# Altium schematic sheet chickenFlap.SchDoc
size A4; SheetNumber: 1; SheetTotal: 3
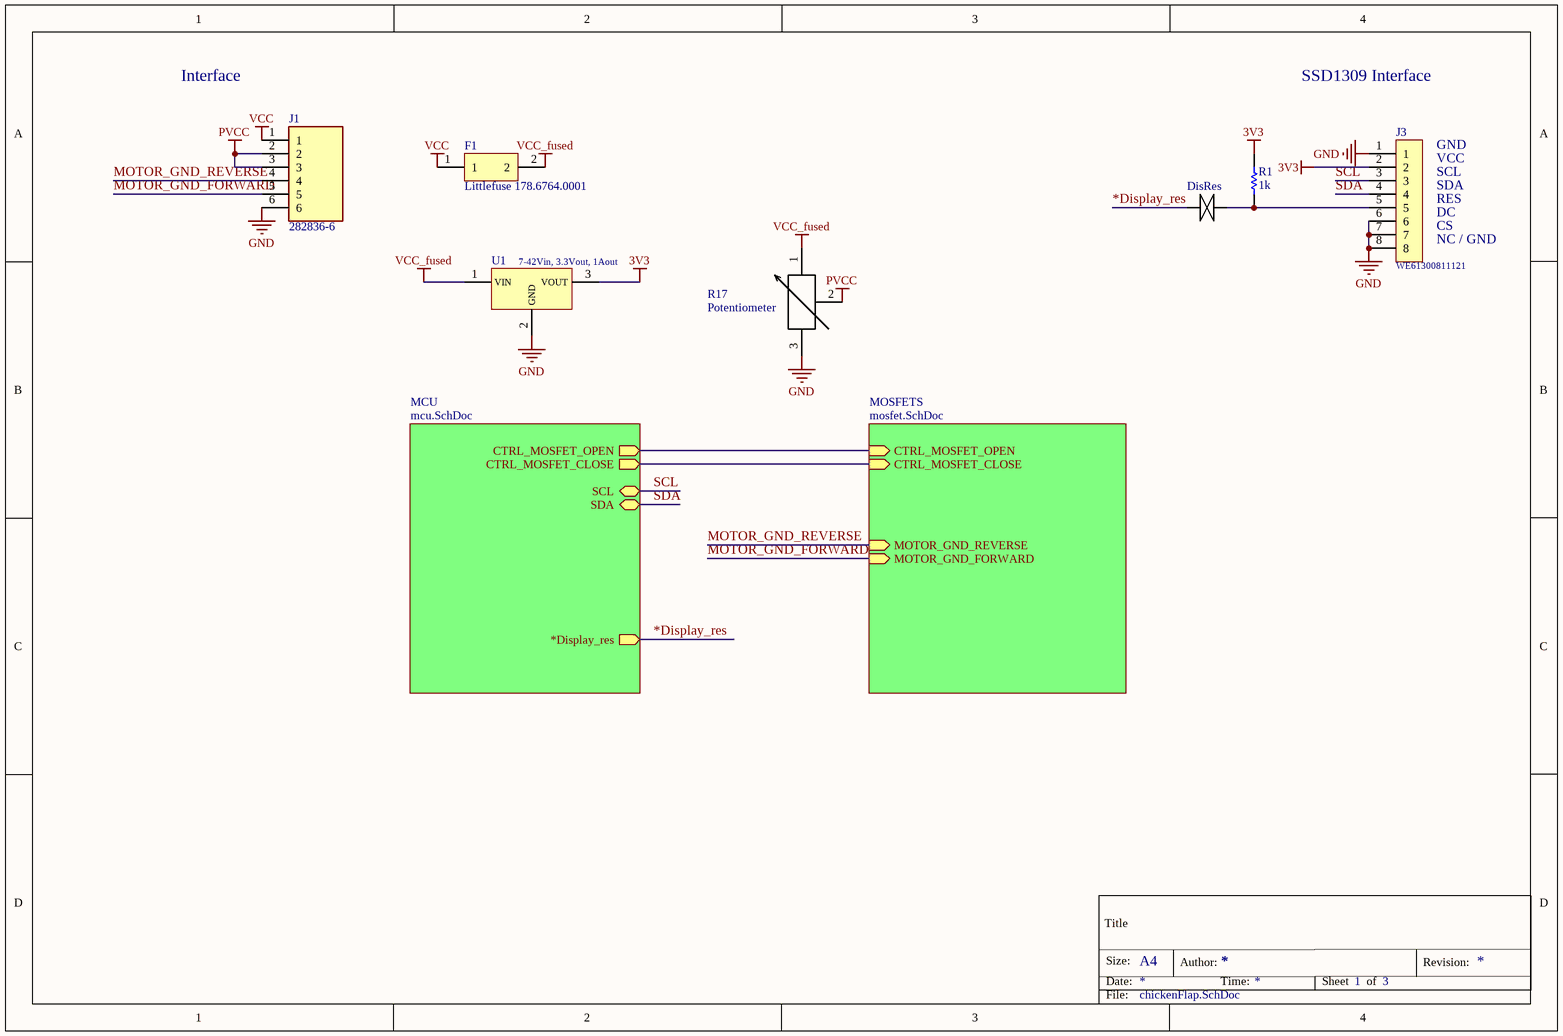
[diagram p0: chickenFlap.SchDoc]

## Parts
DisRes  DisRes  [JUMPER_SINGLE_SMALL]  (value not drawn)
F1  Littlefuse 178.6764.0001  [MINI/FK1]
J1  282836-6  [2828366]
J3  WE61300811121  [WE61300811121]
R1  1k  [RES0603]
R17  Potentiometer  [Potentiometer]
U1  7-42Vin, 3.3Vout, 1Aout  [MagI³C-FDSM_SIP-3_173010x42]

## Sub-sheets
MCU = mcu.SchDoc: CTRL_MOSFET_CLOSE (out), CTRL_MOSFET_OPEN (out), *Display_res (out), SCL (bidir), SDA (bidir)
MOSFETS = mosfet.SchDoc: CTRL_MOSFET_OPEN (in), CTRL_MOSFET_CLOSE (in), MOTOR_GND_REVERSE (in), MOTOR_GND_FORWARD (in)

## Nets
3V3: J3.2 R1.2 U1.3(VOUT)
GND: J1.6 J3.1 J3.6 J3.7 J3.8 R17.3 U1.2(GND)
PVCC: J1.2 J1.3 R17.2
VCC: F1.1 J1.1
VCC_fused: F1.2 R17.1 U1.1(VIN)
*Display_res: DisRes.2(B) ; sheet MCU/*Display_res
MOTOR_GND_FORWARD: J1.5 ; sheet MOSFETS/MOTOR_GND_FORWARD
MOTOR_GND_REVERSE: J1.4 ; sheet MOSFETS/MOTOR_GND_REVERSE
SCL: J3.3 ; sheet MCU/SCL
SDA: J3.4 ; sheet MCU/SDA
NetDisRes_1: DisRes.1(A) J3.5 R1.1
(unnamed): sheet MCU/CTRL_MOSFET_CLOSE, sheet MOSFETS/CTRL_MOSFET_CLOSE
(unnamed): sheet MCU/CTRL_MOSFET_OPEN, sheet MOSFETS/CTRL_MOSFET_OPEN

## Notes on the sheet
- Interface
- SSD1309 Interface
- (near J3) VCC
- (near J3) SCL
- (near J3) GND
- (near J3) CS
- (near J3) DC
- (near J3) RES
- (near J3) SDA
- (near J3) NC / GND
- Title
- Size:
- Date:
- A4
- Author:
- Time:
- Sheet
- of
- Revision:
- File:

## Library data of the parts
DisRes = JUMPER_SINGLE: 2 pads which can be connected truth soldering
F1 = Fuse Mini/FK1: Fuse holder for MINI/ FK1 fuses for PCB applications. The FL1 Fuse Holder can be mounted in a row of nearly any number. The terminals fit into a 7.62 mm pitch.
J1 = 282836-6: Connector; Manufacturer_Name: TE Connectivity; Datasheet Link: https://www.te.com/commerce/DocumentDelivery/DDEController?Action=showdoc&DocId=Customer+Drawing%7F282836%7FJ%7Fpdf%7FEnglish%7FENG_CD_282836_J.pdf%7F282836-6; Height: 10.2mm; Manufacturer_Part_Number: 282836-6; Mouser Part Number: 571-2828366; Mouser Price/Stock: https://www.mouser.co.uk/ProductDetail/TE-Connectivity/282836-6/?qs=A%252Bip%252BNCYi6MsYFpaQLKbfg%3D%3D; Arrow Part Number: 282836-6; Arrow Price/Stock: https://www.arrow.com/en/products/282836-6/te-connectivity?region=nac
J3 = WE61300811121: WR-PHD Pin Header, THT, pitch 2.54mm, Single Row, Vertical, 8pin; Pin Number: 8; Gender: Male; Rated Current: 3A; Working Voltage: 250VAC; Withstanding Voltage: 500VAC; Contact Resistance: 20mOhm; ComponentLink1Description: Manufacturer; ComponentLink1URL: http://www.we-online.de; ComponentLink2Description: Datasheet; ComponentLink2URL: https://katalog.we-online.de/em/datasheet/6130xx11121.pdf; Part Number: 61300811121; Published Date: June 2019; Publisher: Wurth Elektronik; Pitch: 2.54mm; Operating Temperature: -40 to +105degC; Mounting Technology: THT; Packaging: Bag; Row Number: Single; Orientation: Vertical
R1 = Resistor 0603: Chip Resistor 0603, Body 1.6x0.8mm, IPC Medium Density; Value: 1k
U1 = WE173010342: MagI³C-FDSM Fixed Step Down Regulator Module, THT, SIP-3, 7-42Vin, 3.3Vout, 1Aout; Output Voltage: 3.3V; Output Current: 1A; Input Voltage: 7-42V; ComponentLink1Description: Manufacturer; ComponentLink1URL: http://www.we-online.de; ComponentLink2Description: Datasheet; ComponentLink2URL: https://katalog.we-online.com/pm/datasheet/173010342.pdf; Part Number: 173010342; Published Date: April 2019; Publisher: Wurth Elektronik; Size: SIP-3; Mounting Technology: THT; Operating Temperature: -40 to +85degC; Packaging: Tube